# EAGLE design slave (EAGLE 8.5.2)
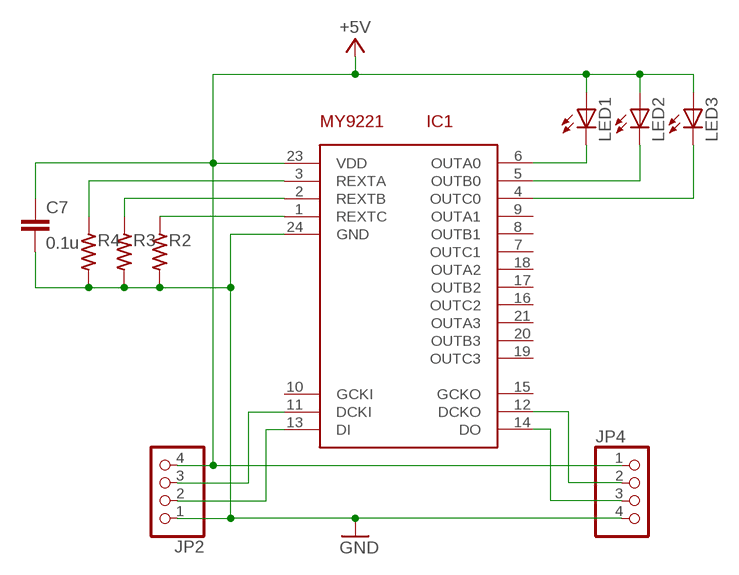
[diagram p0: schematic, sheet 1]

## Parts
C7  0.1u  C-EUC1608  [C1608]
IC1  MY9221SS  [SSOP24]
JP2  PINHD-1X4  [1X04]
JP4  PINHD-1X4  [1X04]
LED1  LED5MM  [LED5MM]
LED2  LED5MM  [LED5MM]
LED3  LED5MM  [LED5MM]
R2  RESISTOR-US1608  [SMD1608]
R3  RESISTOR-US1608  [SMD1608]
R4  RESISTOR-US1608  [SMD1608]

## Nets
+5V: C7.1 IC1.23(VDD) JP2.4 JP4.1 LED1.A LED2.A LED3.A
GND: C7.2 IC1.24(GND) JP2.1 JP4.4 R2.2 R3.2 R4.2
N$1: IC1.11(DCKI) JP2.3
N$4: IC1.13(DI) JP2.2
N$7: IC1.12(DCKO) JP4.2
N$9: IC1.14(DO) JP4.3
N$14: IC1.1(REXTC) R2.1
N$15: IC1.2(REXTB) R3.1
N$16: IC1.3(REXTA) R4.1
N$17: IC1.6(OUTA0) LED1.K(C)
N$18: IC1.5(OUTB0) LED2.K(C)
N$19: IC1.4(OUTC0) LED3.K(C)
Unconnected: IC1.7(OUTC1) IC1.8(OUTB1) IC1.9(OUTA1) IC1.10(GCKI) IC1.15(GCKO) IC1.16(OUTC2) IC1.17(OUTB2) IC1.18(OUTA2) IC1.19(OUTC3) IC1.20(OUTB3) IC1.21(OUTA3)

## Library data of the parts
C7 = rcl:C-EU: CAPACITOR, European symbol; SPICEPREFIX: C
IC1 = akizuki:MY9221SS
JP2 JP4 = pinhead:PINHD-1X4: PIN HEADER
LED1-LED3 = led:LED: LED OSRAM: - CHIPLED LG R971, LG N971, LY N971, LG Q971, LY Q971, LO R971, LY R971 LH N974, LH R974 LS Q976, LO Q976, LY Q976 LO Q996 - Hyper CHIPLED LW Q18S LB Q993, LB Q99A, LB R99A - SideLED LS A670, LO A670, LY A670, LG A670, LP A670 LB A673, LV A673, LT A673, LW A673 LH A674 LY A675 LS A676, LA A676, LO A676, LY A676, LW A676 LS A679, LY A679, LG A679 - Hyper Micro SIDELED® LS Y876, LA Y876, LO Y876, LY Y876 LT Y87S - SmartLED LW L88C, LW L88S LB L89C, LB L89S, LG L890 LS L89K, LO L89K, LY L89K LS L896, LA L896, LO L896, LY L896 - TOPLED LS T670, LO T670, LY T670, LG T670, LP T670 LSG T670, LSP T670, LSY T670, LOP T670, LYG T670 LG T671, LOG T671, LSG T671 LB T673, LV T673, LT T673, LW T673 LH T674 LS T676, LA T676, LO T676, LY T676, LB T676, LH T676, LSB T676, LW T676 LB T67C, LV T67C, LT T67C, LS T67K, LO T67K, LY T67K, LW E67C LS E67B, LA E67B, LO E67B, LY E67B, LB E67C, LV E67C, LT E67C LW T67C LS T679, LY T679, LG T679 LS T770, LO T770, LY T770, LG T770, LP T770 LB T773, LV T773, LT T773, LW T773 LH T774 LS E675, LA E675, LY E675, LS T675 LS T776, LA T776, LO T776, LY T776, LB T776 LHGB T686 LT T68C, LB T68C - Hyper Mini TOPLED® LB M676 - Mini TOPLED Santana® LG M470 LS M47K, LO M47K, LY M47K Source: http://www.osram.convergy.de LUXEON: - LUMILED® LXK2-PW12-R00, LXK2-PW12-S00, LXK2-PW14-U00, LXK2-PW14-V00 LXK2-PM12-R00, LXK2-PM12-S00, LXK2-PM14-U00 LXK2-PE12-Q00, LXK2-PE12-R00, LXK2-PE12-S00, LXK2-PE14-T00, LXK2-PE14-U00 LXK2-PB12-K00, LXK2-PB12-L00, LXK2-PB12-M00, LXK2-PB14-N00, LXK2-PB14-P00, LXK2-PB14-Q00 LXK2-PR12-L00, LXK2-PR12-M00, LXK2-PR14-Q00, LXK2-PR14-R00 LXK2-PD12-Q00, LXK2-PD12-R00, LXK2-PD12-S00 LXK2-PH12-R00, LXK2-PH12-S00 LXK2-PL12-P00, LXK2-PL12-Q00, LXK2-PL12-R00 Source: www.luxeon.com KINGBRIGHT: KA-3528ASYC Source: www.kingbright.com
R2-R4 = generic:RESISTOR-US: Generic Registor

## Board
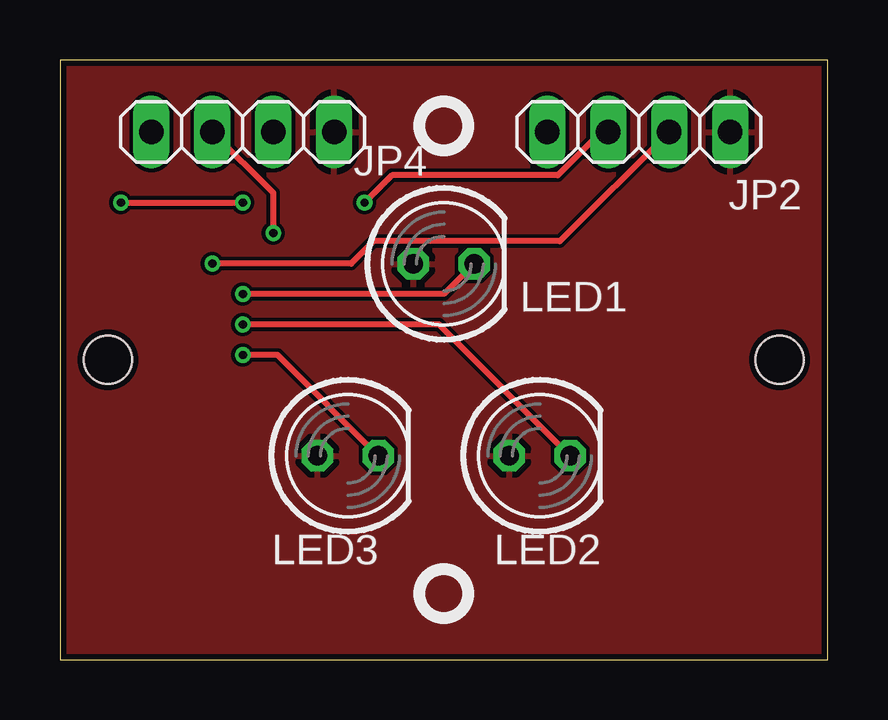
[diagram p1: board, top side]
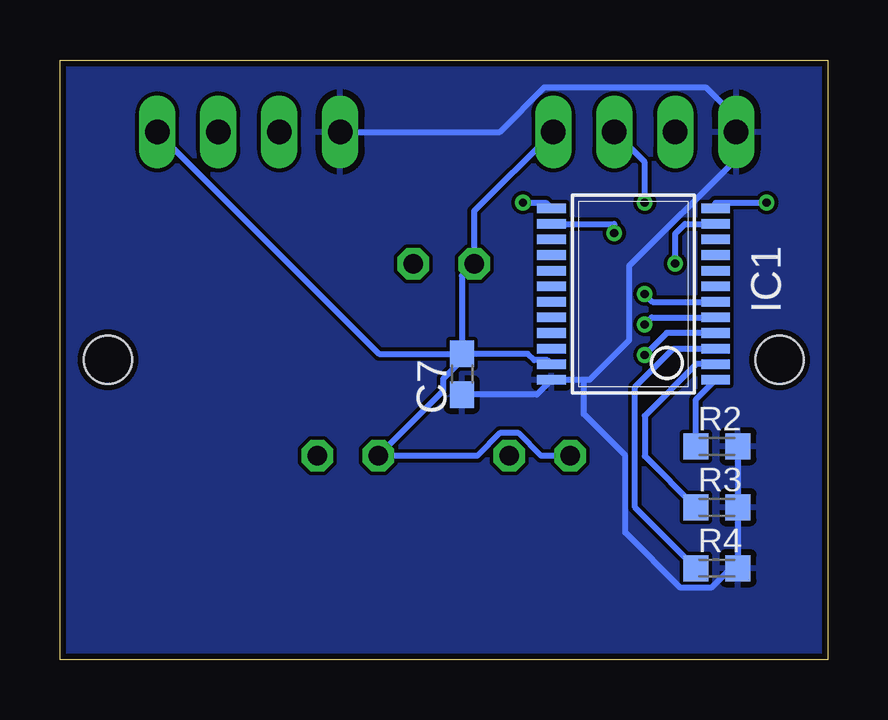
[diagram p2: board, bottom side, seen from below]

Size 32 x 25 mm. Coordinates in mm from the lower left corner, seen from the top.
Outline: 0,0 32,0 32,25 0,25 0,0
Copper layers (1*16): Top 0.035mm / dielectric 1.5mm / Bottom 0.035mm
Design rules "SeeedStudio_2layer_DRU_no_angle_20140221": minimum track width 6mil, minimum drill 12mil, track to track 6mil, track to pad 6mil, pad to pad 6mil, via to via 6mil, smd to smd 0mil, copper to edge 10mil, drill to drill 10mil, minimum pad ring 10mil, minimum via ring 6mil, stop-mask expansion 2mil, vias tented up to drill 100mil, thermal gap 10mil
Holes 2 mm at 2,12.5 30,12.5

### Footprints (pad centres in the part's own frame; a part is rotated, then mirrored left to right if it is on the bottom)
C1608 = smd 1.1 x 1: 1 -0.85,0; 2 0.85,0
SSOP24 = smd 0.4 x 1.2: 1 -3.575,-3.42; 2 -2.925,-3.42; 3 -2.275,-3.42; 4 -1.625,-3.42; 5 -0.975,-3.42; 6 -0.325,-3.42; 7 0.325,-3.42; 8 0.975,-3.42; 9 1.625,-3.42; 10 2.275,-3.42; 11 2.925,-3.42; 12 3.575,-3.42; 13 3.575,3.42; 14 2.925,3.42; 15 2.275,3.42; 16 1.625,3.42; 17 0.975,3.42; 18 0.325,3.42; 19 -0.325,3.42; 20 -0.975,3.42; 21 -1.625,3.42; 22 -2.275,3.42; 23 -2.925,3.42; 24 -3.575,3.42
1X04 = drill 1.016 long: 1 -3.81,0; 2 -1.27,0; 3 1.27,0; 4 3.81,0
LED5MM = drill 0.813 octagon: A -1.27,0; K 1.27,0
SMD1608 = smd 1.05 x 1.08: 1 -0.875,0; 2 0.875,0

### Placement (x,y rotation side)
C7  15.24,11.9 270 bottom
IC1  8.09,15.24 90 bottom
JP2  24.13,22 0 top
JP4  7.62,22 180 top
LED1  16,16.5 0 top
LED2  20,8.5 0 top
LED3  12,8.5 0 top
R2  4.61,8.89 0 bottom
R3  4.61,6.35 0 bottom
R4  4.61,3.81 0 bottom

### Tracks (layer width: path | path; a pad name or v marks a point on that pad's centre or on a via)
+5V
  Bottom 0.254: JP4.1 14.73,18.7 LED1.A 15.24,15.99 C7.1 | LED3.A 11.94,8.5 12.88,9.44 13.66,9.44 14.6,8.5 LED2.A 16.02,11.21 16.02,11.72 15.24,12.49 C7.1 | IC1.23 11.68,12.49 12.23,12.49 12.49,12.75 C7.1 | JP2.4 18.69,12.75 C7.1
  pour Top: 0,0 33.02,0 33.02,25.4 0,25.4
GND
  Bottom 0.254: R2.2 R3.2 R4.2 4.03,3.81 4.84,2.99 6.13,2.99 8.43,5.3 8.43,8.51 10.16,10.23 10.16,11.66 | 10.16,11.66 9.93,11.66 8.28,13.31 8.28,16.4 3.81,20.87 JP4.4 3.81,22.59 5.08,23.86 11.81,23.86 13.66,22 JP2.1 | 10.16,11.66 IC1.24 12.12,11.05 C7.2
  pour Bottom: 0,0 33.02,0 33.02,25.4 0,25.4
N$1  (via drill 0.35)
  Top 0.254: v6.35,16.51 12.14,16.51 13.07,17.44 20.84,17.44 JP2.3
  Bottom 0.254: v6.35,16.51 6.35,17.75 5.94,18.16 IC1.11
N$4  (via drill 0.35)
  Top 0.254: JP2.2 22.55,22 20.75,20.2 13.85,20.2 v12.7,19.05
  Bottom 0.254: v12.7,19.05 11.74,19.05 IC1.13
N$7  (via drill 0.35)
  Top 0.254: v2.54,19.05 v7.62,19.05
  Bottom 0.254: IC1.12 4.67,19.05 v2.54,19.05 | v7.62,19.05 7.62,20.73 JP4.2
N$9  (via drill 0.35)
  Top 0.254: JP4.3 8.89,19.46 v8.89,17.78
  Bottom 0.254: IC1.14 8.89,18.16 v8.89,17.78
N$14
  Bottom 0.254: R2.1 5.49,10.85 IC1.1
N$15
  Bottom 0.254: R3.1 7.62,8.48 7.62,10.16 5.46,12.31 IC1.2
N$16
  Bottom 0.254: R4.1 8.03,6.35 8.03,11.36 6.42,12.96 IC1.3
N$17  (via drill 0.35)
  Top 0.254: LED1.K 16.01,15.24 v7.62,15.24
  Bottom 0.254: v7.62,15.24 7.29,14.91 IC1.6
N$18  (via drill 0.35)
  Top 0.254: LED2.K 15.8,13.97 v7.62,13.97
  Bottom 0.254: v7.62,13.97 7.33,14.27 IC1.5
N$19  (via drill 0.35)
  Top 0.254: LED3.K 9.07,12.7 v7.62,12.7
  Bottom 0.254: IC1.4 6.71,13.62 v7.62,12.7